# EAGLE design 2-6-2012-b (EAGLE 5.11)
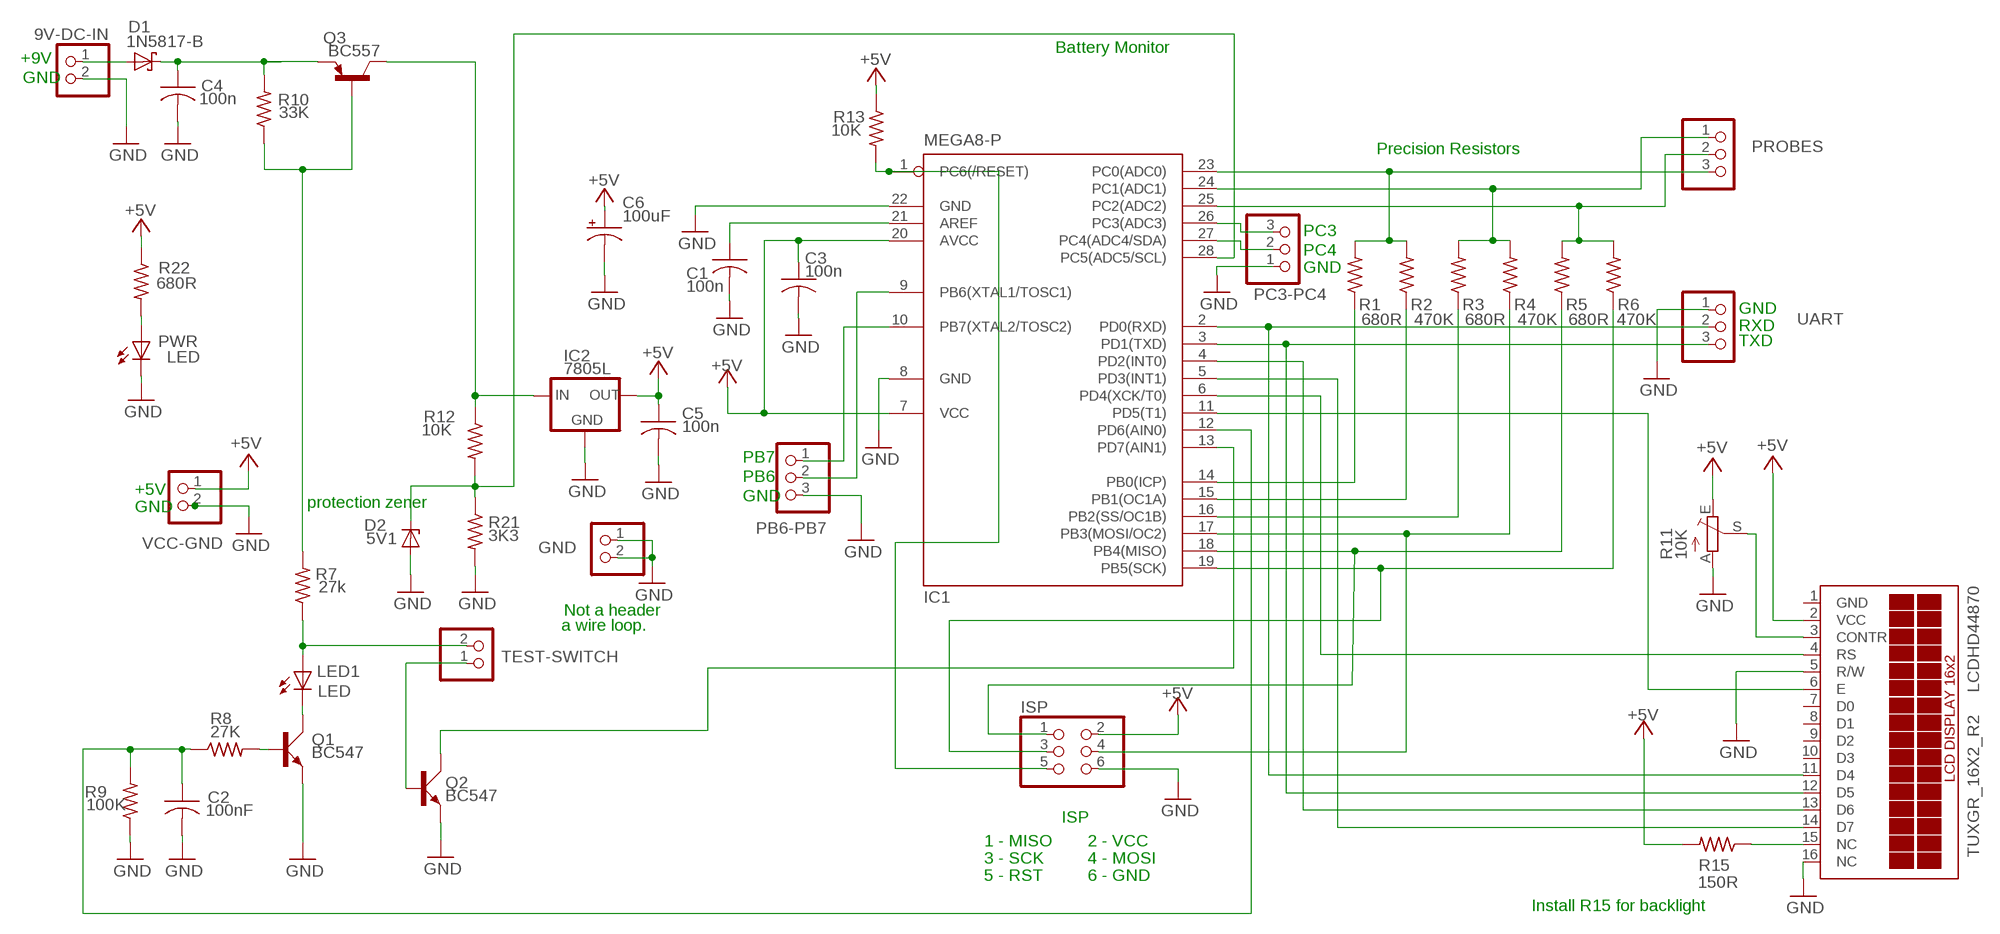
[diagram p0: schematic, sheet 1]

## Parts
9V-DC-IN  PINHD-1X2  [1X02]
C1  100n  C-US025-030X050  [C025-030X050]
C2  100nF  C-US025-030X050  [C025-030X050]
C3  100n  C-US025-030X050  [C025-030X050]
C4  100n  C-US025-030X050  [C025-030X050]
C5  100n  C-US025-030X050  [C025-030X050]
C6  100uF  CPOL-USE2-5  [E2-5]
D1  1N5817-B  [DO41-7.6]
D2  5V1  BZX55  [DO35Z10]
GND  PINHD-1X2  [1X02]
IC1  MEGA8-P  [DIL28-3]
IC2  7805L  78LXX  [78LXX]
ISP  PINHD-2X3  [2X03]
LCDHD44870  TUXGR_16X2_R2  [TUXGR_16X2_R2]
LED1  LED  LED3MM  [LED3MM]
PB6-PB7  PINHD-1X3  [1X03]
PC3-PC4  PINHD-1X3  [1X03]
PROBES  PINHD-1X3  [1X03]
PWR  LED  LED3MM  [LED3MM]
Q1  BC547  [SOT54A]
Q2  BC547  [SOT54A]
Q3  BC557  [TO92]
R1  680R  R-US_0204/7  [0204/7]
R2  470K  R-US_0204/7  [0204/7]
R3  680R  R-US_0204/7  [0204/7]
R4  470K  R-US_0204/7  [0204/7]
R5  680R  R-US_0204/7  [0204/7]
R6  470K  R-US_0204/7  [0204/7]
R7  27k  R-US_0204/7  [0204/7]
R8  27K  R-US_0204/7  [0204/7]
R9  100K  R-US_0204/7  [0204/7]
R10  33K  R-US_0204/7  [0204/7]
R11  10K  TRIM_EU-CA9V  [CA9V]
R12  10K  R-US_0204/7  [0204/7]
R13  10K  R-US_0204/7  [0204/7]
R15  150R  R-US_0204/7  [0204/7]
R21  3K3  R-US_0204/7  [0204/7]
R22  680R  R-US_0204/7  [0204/7]
TEST-SWITCH  PINHD-1X2  [1X02]
UART  PINHD-1X3  [1X03]
VCC-GND  PINHD-1X2  [1X02]

## Nets
+5V: C3.1 C5.1 C6.+ IC1.7(VCC) IC1.20(AVCC) IC2.OUT ISP.2 LCDHD44870.2(VCC) R11.E R13.1 R15.2 R22.1 VCC-GND.1
BAT-MON: D2.C IC1.28(PC5(ADC5/SCL)) R12.2 R21.1
GND: 9V-DC-IN.2 C1.2 C2.2 C3.2 C4.2 C5.2 C6.- D2.A GND.1 GND.2 IC1.8(GND) IC1.22(GND) IC2.GND ISP.6 LCDHD44870.5(R/W) LCDHD44870.16(NC) PB6-PB7.3 PC3-PC4.1 PWR.K(C) Q1.E Q2.E R9.1 R11.A R21.2 UART.1 VCC-GND.2
MISO: IC1.18(PB4(MISO)) ISP.1 R5.1
MOSI: IC1.17(PB3(MOSI/OC2)) ISP.4 R4.1
N$1: IC2.IN Q3.3(C) R12.1
N$2: 9V-DC-IN.1 D1.A
N$3: IC1.23(PC0(ADC0)) PROBES.3 R1.2 R2.2
N$4: IC1.13(PD7(AIN1)) Q2.C
N$5: IC1.25(PC2(ADC2)) PROBES.2 R5.2 R6.2
N$6: IC1.14(PB0(ICP)) R1.1
N$7: IC1.15(PB1(OC1A)) R2.1
N$8: IC1.16(PB2(SS/OC1B)) R3.1
N$9: PWR.A R22.2
N$12: Q3.2(B) R7.2 R10.1
N$13: IC1.6(PD4(XCK/T0)) LCDHD44870.4(RS)
N$15: IC1.24(PC1(ADC1)) PROBES.1 R3.2 R4.2
N$16: Q1.B R8.2
N$19: IC1.9(PB6(XTAL1/TOSC1)) PB6-PB7.2
N$20: LED1.A R7.1 TEST-SWITCH.2
N$21: LED1.K(C) Q1.C
N$22: Q2.B TEST-SWITCH.1
N$23: C2.1 IC1.12(PD6(AIN0)) R8.1 R9.2
N$24: IC1.11(PD5(T1)) LCDHD44870.6(E)
N$26: IC1.4(PD2(INT0)) LCDHD44870.13(D6)
N$27: IC1.5(PD3(INT1)) LCDHD44870.14(D7)
N$28: LCDHD44870.3(CONTR) R11.S
N$29: C1.1 IC1.21(AREF)
N$30: IC1.10(PB7(XTAL2/TOSC2)) PB6-PB7.1
N$31: LCDHD44870.15(NC) R15.1
N$33: C4.1 D1.C Q3.1(E) R10.2
N$34: IC1.26(PC3(ADC3)) PC3-PC4.3
N$37: IC1.27(PC4(ADC4/SDA)) PC3-PC4.2
RST: IC1.1(PC6(/RESET)) ISP.5 R13.2
RXD: IC1.2(PD0(RXD)) LCDHD44870.11(D4) UART.2
SCK: IC1.19(PB5(SCK)) ISP.3 R6.1
TXD: IC1.3(PD1(TXD)) LCDHD44870.12(D5) UART.3
Unconnected: LCDHD44870.7(D0) LCDHD44870.8(D1) LCDHD44870.9(D2) LCDHD44870.10(D3)

## Notes on the sheet
- Battery Monitor
- +9V
- GND
- Precision Resistors
- PC3
- PC4
- GND
- GND
- RXD
- TXD
- PB7
- PB6
- +5V
- GND
- GND | protection zener
- Not a header
- a wire loop.
- ISP
- 1 - MISO | 2 - VCC
- 3 - SCK | 4 - MOSI
- 5 - RST | 6 - GND
- Install R15 for backlight

## Power pins joined to a net without a drawn wire
GND: LCDHD44870.1(GND)

## Library data of the parts
9V-DC-IN GND TEST-SWITCH VCC-GND = pinhead:PINHD-1X2: PIN HEADER
C1-C5 = rcl:C-US: CAPACITOR, American symbol
C6 = rcl:CPOL-US: POLARIZED CAPACITOR, American symbol
D1 = diode:1N581*: 1.0A SCHOTTKY BARRIER RECTIFIER Source: http://www.diodes.com/datasheets/ds23001.pdf
D2 = diode:BZX55: Z DIODE
IC1 = atmel:MEGA8-P: MICROCONTROLLER 8 Kbytes FLASH, 1 kbytes SRAM, 512 bytes EEPROM, USART, 4-channel 10 bit ADC, 2-channel 8 bit ADC Pin compatible with Atmega48, ATMega88, ATMega168 Source: avr.lbr; OC_FARNELL: unknown; OC_NEWARK: unknown
IC2 = v-reg:78LXX: VOLTAGE REGULATOR
ISP = pinhead:PINHD-2X3: PIN HEADER
LCDHD44870 = display-lcd:TUXGR_16X2_R2: Tuxgraphics LCD display 16x2 characters reflective, without background light Source: tuxgr_12x2_r2.pdf; OC_FARNELL: unknown; OC_NEWARK: unknown
LED1 PWR = led:LED: LED OSRAM: - CHIPLED LG R971, LG N971, LY N971, LG Q971, LY Q971, LO R971, LY R971 LH N974, LH R974 LS Q976, LO Q976, LY Q976 LO Q996 - Hyper CHIPLED LW Q18S LB Q993, LB Q99A, LB R99A - SideLED LS A670, LO A670, LY A670, LG A670, LP A670 LB A673, LV A673, LT A673, LW A673 LH A674 LY A675 LS A676, LA A676, LO A676, LY A676, LW A676 LS A679, LY A679, LG A679 - Hyper Micro SIDELED® LS Y876, LA Y876, LO Y876, LY Y876 LT Y87S - SmartLED LW L88C, LW L88S LB L89C, LB L89S, LG L890 LS L89K, LO L89K, LY L89K LS L896, LA L896, LO L896, LY L896 - TOPLED LS T670, LO T670, LY T670, LG T670, LP T670 LSG T670, LSP T670, LSY T670, LOP T670, LYG T670 LG T671, LOG T671, LSG T671 LB T673, LV T673, LT T673, LW T673 LH T674 LS T676, LA T676, LO T676, LY T676, LB T676, LH T676, LSB T676, LW T676 LB T67C, LV T67C, LT T67C, LS T67K, LO T67K, LY T67K, LW E67C LS E67B, LA E67B, LO E67B, LY E67B, LB E67C, LV E67C, LT E67C LW T67C LS T679, LY T679, LG T679 LS T770, LO T770, LY T770, LG T770, LP T770 LB T773, LV T773, LT T773, LW T773 LH T774 LS E675, LA E675, LY E675, LS T675 LS T776, LA T776, LO T776, LY T776, LB T776 LHGB T686 LT T68C, LB T68C - Hyper Mini TOPLED® LB M676 - Mini TOPLED Santana® LG M470 LS M47K, LO M47K, LY M47K Source: http://www.osram.convergy.de LUXEON: - LUMILED® LXK2-PW12-R00, LXK2-PW12-S00, LXK2-PW14-U00, LXK2-PW14-V00 LXK2-PM12-R00, LXK2-PM12-S00, LXK2-PM14-U00 LXK2-PE12-Q00, LXK2-PE12-R00, LXK2-PE12-S00, LXK2-PE14-T00, LXK2-PE14-U00 LXK2-PB12-K00, LXK2-PB12-L00, LXK2-PB12-M00, LXK2-PB14-N00, LXK2-PB14-P00, LXK2-PB14-Q00 LXK2-PR12-L00, LXK2-PR12-M00, LXK2-PR14-Q00, LXK2-PR14-R00 LXK2-PD12-Q00, LXK2-PD12-R00, LXK2-PD12-S00 LXK2-PH12-R00, LXK2-PH12-S00 LXK2-PL12-P00, LXK2-PL12-Q00, LXK2-PL12-R00 Source: www.luxeon.com KINGBRIGHT: KA-3528ASYC Source: www.kingbright.com
PB6-PB7 PC3-PC4 PROBES UART = pinhead:PINHD-1X3: PIN HEADER
Q1 Q2 = transistor-small-signal:BC547: NPN TRANSISTOR
Q3 = transistor-pnp:BC557: PNP Transistor
R1-R10 R12 R13 R15 R21 R22 = rcl:R-US_: RESISTOR, American symbol
R11 = pot:TRIM_EU-: POTENTIOMETER

## Board
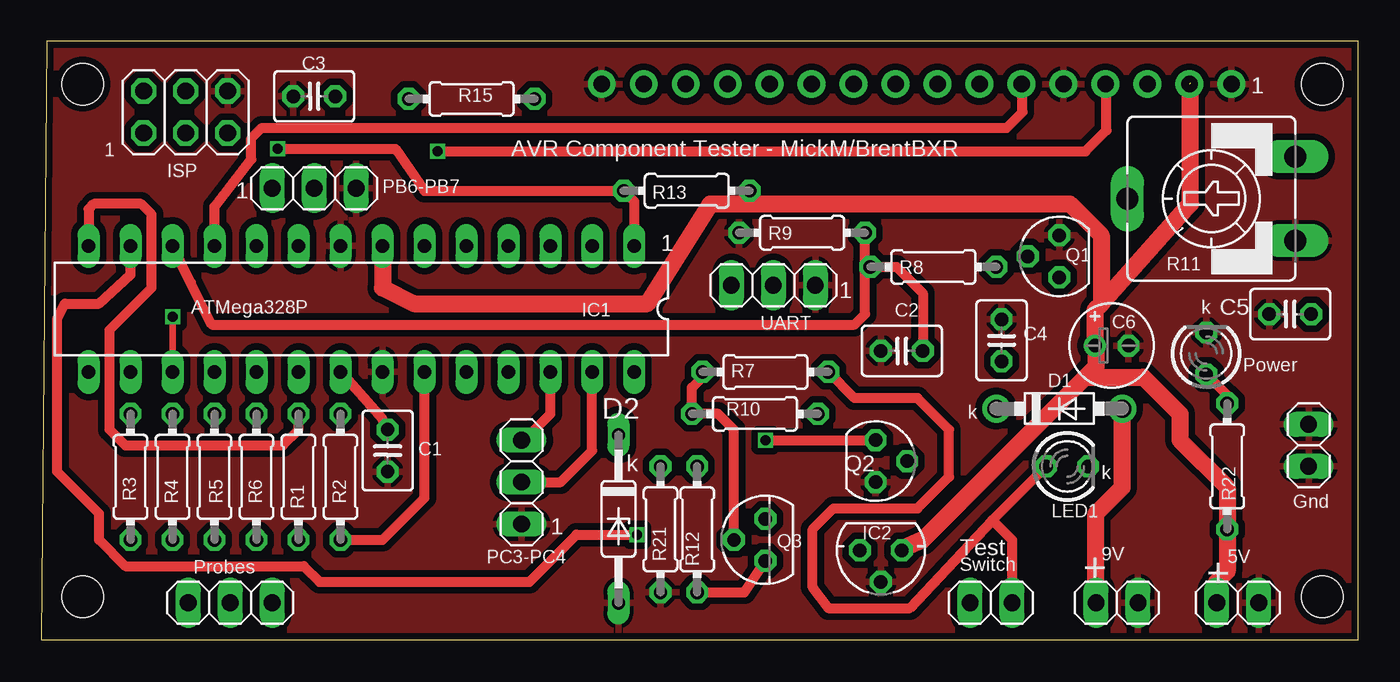
[diagram p1: board, top side]
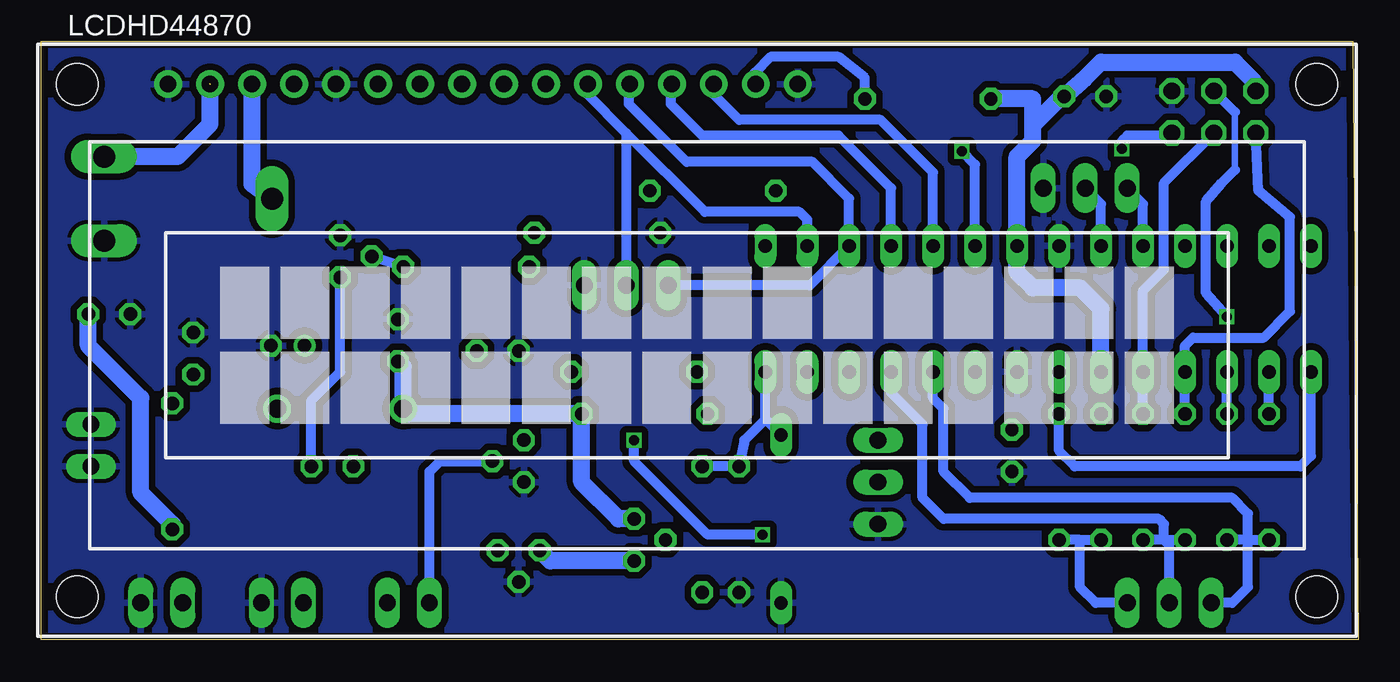
[diagram p2: board, bottom side, seen from below]

Size 79.68 x 36.18 mm. Coordinates in mm from the lower left corner, seen from the top.
Outline: 0,0 79.68,0 79.68,36.18 0.32,36.18 0,0
Copper layers (1*16): Top 0.035mm / dielectric 1.5mm / Bottom 0.035mm
Design rules "Fusion_eagle_rule_v1.1": minimum track width 6mil, minimum drill 12mil, track to track 10mil, track to pad 10mil, pad to pad 10mil, via to via 10mil, smd to smd 0mil, copper to edge 10mil, drill to drill 10mil, minimum pad ring 10mil, minimum via ring 6mil, stop-mask expansion 2mil, vias tented up to drill 100mil, thermal gap 10mil

### Footprints (pad centres in the part's own frame; a part is rotated, then mirrored left to right if it is on the bottom)
1X02 = drill 1.016 long: 1 -1.27,0; 2 1.27,0
C025-030X050 = drill 0.813 octagon: 1 -1.27,0; 2 1.27,0
E2-5 = drill 0.813 pad 1.27 round: + -1.016,0 | drill 0.813 pad 1.27 octagon: - 1.016,0
DO41-7.6 = drill 1.1 pad 1.7 round: A 3.81,0; C -3.81,0
DO35Z10 = drill 0.813 long: A 5.08,0; C -5.08,0
DIL28-3 = drill 0.813 long: 1 -16.51,-3.81; 2 -13.97,-3.81; 3 -11.43,-3.81; 4 -8.89,-3.81; 5 -6.35,-3.81; 6 -3.81,-3.81; 7 -1.27,-3.81; 8 1.27,-3.81; 9 3.81,-3.81; 10 6.35,-3.81; 11 8.89,-3.81; 12 11.43,-3.81; 13 13.97,-3.81; 14 16.51,-3.81; 15 16.51,3.81; 16 13.97,3.81; 17 11.43,3.81; 18 8.89,3.81; 19 6.35,3.81; 20 3.81,3.81; 21 1.27,3.81; 22 -1.27,3.81; 23 -3.81,3.81; 24 -6.35,3.81; 25 -8.89,3.81; 26 -11.43,3.81; 27 -13.97,3.81; 28 -16.51,3.81
78LXX = drill 0.813 octagon: GND 0,1.905; IN 1.27,0; OUT -1.27,0
2X03 = drill 1.016 octagon: 1 -2.54,-1.27; 2 -2.54,1.27; 3 0,-1.27; 4 0,1.27; 5 2.54,-1.27; 6 2.54,1.27
TUXGR_16X2_R2 = drill 1 pad 1.676 round: 1 -32,15.5; 2 -29.46,15.5; 3 -26.92,15.5; 4 -24.38,15.5; 5 -21.84,15.5; 6 -19.3,15.5; 7 -16.76,15.5; 8 -14.22,15.5; 9 -11.68,15.5; 10 -9.14,15.5; 11 -6.6,15.5; 12 -4.06,15.5; 13 -1.52,15.5; 14 1.02,15.5; 15 3.56,15.5; 16 6.1,15.5 | hole 2.5: -37.5,-15.5; 37.5,-15.5; -37.5,15.5; 37.5,15.5
LED3MM = drill 0.813 octagon: A -1.27,0; K 1.27,0
1X03 = drill 1.016 long: 1 -2.54,0; 2 0,0; 3 2.54,0
SOT54A = drill 0.813 octagon: B 0,1.905; C -1.27,0; E 1.27,0
TO92 = drill 0.813 octagon: 1 1.27,0; 2 0,1.905; 3 -1.27,0
0204/7 = drill 0.813 octagon: 1 -3.81,0; 2 3.81,0
CA9V = drill 1.321 long: A -2.54,-5.08; E 2.54,-5.08; S 0,5.08

### Placement (x,y rotation side)
9V-DC-IN  65.09,2.22 0 top
C1  20.96,11.43 270 top
C2  52.07,17.46 180 top
C3  16.51,32.86 180 top
C4  58.1,18.1 90 top
C5  75.57,19.69 180 top
C6  64.77,17.78 0 top
D1  61.59,13.97 0 top
D2  34.92,7.3 270 top
GND  76.68,11.75 90 top
IC1  19.37,20 180 top
IC2  50.8,5.4 180 top
ISP  8.73,31.91 0 top
LCDHD44870  40,18.1 0 bottom
LED1  62.07,10.48 0 top
PB6-PB7  16.51,27.31 0 top
PC3-PC4  29.05,9.52 90 top
PROBES  11.43,2.22 0 top
PWR  70.49,17.3 90 top
Q1  61.59,23.18 90 top
Q2  50.48,10.8 270 top
Q3  43.81,6.03 90 top
R1  740k  [0204/7]  15.56,9.84 270 top
R2  680R  [0204/7]  18.1,9.84 270 top
R3  740k  [0204/7]  5.4,9.84 270 top
R4  680R  [0204/7]  7.94,9.84 270 top
R5  740K  [0204/7]  10.48,9.84 270 top
R6  680R  [0204/7]  13.02,9.84 270 top
R7  43.81,16.19 180 top
R8  53.97,22.54 0 top
R9  46.04,24.61 0 top
R10  43.18,13.65 0 top
R11  70.8,26.67 90 top
R12  39.69,6.67 90 top
R13  39.05,27.15 180 top
R15  26.04,32.7 180 top
R21  37.47,6.67 270 top
R22  71.75,10.48 90 top
TEST-SWITCH  57.47,2.22 0 top
UART  44.29,21.43 180 top
VCC-GND  72.39,2.22 0 top

### Tracks (layer width: path | path; a pad name or v marks a point on that pad's centre or on a via)
+5V  (1 unrouted)
  Top 0.406: 43.02,26.35 42.86,26.51 | C6.+ 63.82,17.72
  Top 0.61: 42.86,26.51 R13.1
  Top 1.016: IC1.7 20.64,21.27 22.54,20.32 36.67,20.32 40.48,26.35 43.02,26.35 62.23,26.35 64.13,24.45 64.13,20.32 | IC2.OUT 51.91,5.4 53.34,6.03 63.18,15.88 | VCC-GND.1 71.12,3.49 71.75,4.13 R22.1 71.75,9.21 68.9,12.06 68.9,13.65 66.67,15.88 63.18,15.88 | 64.13,20.32 69.53,26.35 69.53,33.65 | 63.18,15.88 63.82,16.51 63.82,17.72 | C6.+ 63.75,19.94 64.13,20.32
  Bottom 0.406: C5.1
  Bottom 0.61: 17.94,32.86 C3.1
  Bottom 1.016: IC1.20 15.56,20 16.83,21.27 19.68,21.27 20.64,22.23 IC1.7 20.64,29.21 19.68,30.16 19.68,31.12 | R15.2 19.68,32.7 19.68,31.12 | ISP.2 6.35,33.81 7.46,34.93 15.56,34.93 16.51,33.97 C3.1 | LCDHD44870.2 69.47,31.18 71.44,29.21 R11.E | C5.1 76.83,17.78 73.66,14.6 73.66,8.89 71.75,6.98 R22.1 | 19.68,31.12 17.94,32.86
BAT-MON
  Bottom 0.61: R12.2 R21.1 37.15,12.06 35.88,13.34 | 35.88,13.34 IC1.28 | D2.C 35.88,13.34
GND
  pour Top (isolate 0.406): 0,36.51 80.01,36.2 79.69,-0.16 -0.32,-0.16
  pour Bottom (isolate 0.406): 0.32,36.51 80.01,36.51 80.01,0 0.32,0
MISO
  Bottom 0.61: ISP.1 6.03,27.15 4.13,25.56 4.13,19.84 5.71,18.26 10,18.26 10.48,17.78 IC1.18 R5.1
MOSI  (via drill 0.6)
  Top 0.406: IC1.17 v7.94,19.53
  Bottom 0.406: 7.46,28.42 7.46,31.91 | 8.25,27.62
  Bottom 0.61: v7.94,19.53 9.21,20.96 9.21,26.51 8.25,27.62 7.46,28.42 | 7.46,31.91 ISP.4 | R4.1 IC1.17
N$1
  Top 0.61: R12.1 42.55,2.86 Q3.3
  Bottom 1.016: Q3.3 48.89,4.76 IC2.IN
N$2
  Top 1.016: 9V-DC-IN.1 63.82,7.62 65.41,9.21 D1.A
N$3
  Top 0.61: R2.2 20.64,6.03 23.18,8.57 IC1.23
  Bottom 0.61: 16.83,6.03 R1.2 | 16.83,6.03 R2.2 | PROBES.3 15.88,2.22 16.83,3.17 16.83,6.03
N$4  (via drill 0.6)
  Top 0.61: IC1.13 5.4,22.07 3.49,20.32 1.43,20.32 0.95,19.37 0.95,10.16 3.49,7.62 3.49,6.03 5.08,4.45 15.88,4.45 16.83,3.49 29.53,3.49 32.39,6.35 v36.04,6.35 | v43.81,12.06 Q2.C
  Bottom 0.61: v36.04,6.35 39.37,6.35 43.81,10.8 v43.81,12.06
N$5
  Bottom 0.406: 28.42,15.4 28.42,16.03 IC1.25
  Bottom 0.61: 11.75,6.03 R5.2 | 11.75,6.03 R6.2 | PROBES.2 11.43,5.71 11.75,6.03 | 11.75,6.03 11.75,6.98 12.07,7.3 25.08,7.3 26.35,8.57 26.35,13.02 28.26,14.92 28.26,15.24 28.42,15.4
N$6
  Top 0.61: IC1.14 2.86,26.04 3.18,26.35 6.03,26.35 6.67,25.72 6.67,21.27 4.13,18.73 4.13,14.92 4.13,12.7 5.08,11.75 14.61,11.75 15.56,12.7 R1.1
N$7
  Bottom 0.406: IC1.15 2.86,12.22
  Bottom 0.61: IC1.15 2.86,11.11 3.49,10.48 17.14,10.48 18.1,11.43 R2.1
N$8
  Bottom 0.61: R3.1 IC1.16
N$9
  Top 0.61: R22.2 71.75,14.76 PWR.A
N$12
  Top 0.406: 40,15.88 R7.2
  Top 0.61: 40,15.88 39.37,15.24 R10.1 40.96,13.65 41.91,12.7 Q3.2
N$13  (via drill 0.6)
  Top 0.406: 64.45,33.53 LCDHD44870.4
  Top 0.61: v23.97,29.53 63.18,29.53 64.45,30.8 64.45,33.53
  Bottom 0.61: IC1.6 23.18,28.73 v23.97,29.53
N$15
  Bottom 0.61: 6.67,6.03 R3.2 | 6.67,6.03 R4.2 | PROBES.1 7.62,2.22 6.67,3.17 6.67,6.03 | IC1.24 25.72,14.6 25.08,13.97 25.08,10.16 23.5,8.57 7.62,8.57 6.67,7.62 6.67,6.03
N$16
  Bottom 0.61: R8.2 Q1.B
N$19
  Bottom 0.406: IC1.9 15.56,24.61
  Bottom 0.61: 15.56,24.61 15.56,26.35 PB6-PB7.2
N$20
  Top 0.61: R7.1 49.21,14.6 53.02,14.6 54.93,12.7 54.93,9.84 53.02,7.94 47.94,7.94 46.67,6.67 46.67,3.17 47.62,1.91 52.55,1.91 57.55,7.22 | 57.55,7.22 LED1.A | TEST-SWITCH.2 58.74,6.03 57.55,7.22
N$21
  Bottom 0.61: LED1.K 63.34,14.45 61.59,16.19 Q1.C
N$22
  Bottom 0.61: Q2.B 55.56,10.8 56.2,10.16 TEST-SWITCH.1
N$23
  Top 0.406: 49.85,22.54 R8.1
  Top 0.61: IC1.12 9.05,21.59 10.32,19.05 49.21,19.05 49.85,19.69 49.85,22.54 R9.2 | C2.1 53.34,20.96 51.75,22.54 R8.1
N$24
  Top 0.406: 59.37,33.53 LCDHD44870.6
  Top 0.61: 59.37,33.53 59.37,31.91 58.42,30.96 13.34,30.96 12.7,30.32 12.7,29.05 10.48,26.19 IC1.11
N$26
  Bottom 0.61: IC1.4 28.26,27.31 31.43,30.48 39.69,30.48 41.59,32.38 41.59,33.53 LCDHD44870.13
N$27
  Bottom 0.406: 39.05,33.53 LCDHD44870.14
  Bottom 0.61: IC1.5 25.72,28.26 28.89,31.43 37.47,31.43 39.05,33.02 39.05,33.53
N$28
  Bottom 1.016: LCDHD44870.3 66.92,27.56 R11.S
N$29
  Top 0.61: IC1.21 20.64,13.34 C1.1
N$30
  Bottom 0.61: IC1.10 13.02,26.35 PB6-PB7.1
N$31
  Bottom 0.406: 36.51,34.29 36.51,33.66
  Bottom 0.61: R15.1 29.85,33.97 31.43,35.24 35.56,35.24 36.51,34.29 | 36.51,33.66 LCDHD44870.15
N$33
  Bottom 0.61: 57.47,13.65 D1.C
  Bottom 1.016: 57.47,13.65 R10.2 46.99,9.52 44.77,7.3 Q3.1 | D1.C 57.78,16.51 C4.1
N$34
  Top 0.61: PC3-PC4.3 29.21,12.06 30.8,13.65 IC1.26
N$37
  Top 0.61: PC3-PC4.2 31.43,9.52 33.34,11.43 IC1.27
RST  (via drill 0.6)
  Top 0.406: R13.2 35.08,27.15
  Top 0.61: v14.29,29.69 21.43,29.69 23.18,27.15 R13.2 35.88,26.51 IC1.1
  Bottom 0.61: v14.29,29.69 14.29,30.16 13.97,30.48 11.43,30.48 ISP.5
RXD
  Bottom 0.406: 46.67,33.53 LCDHD44870.11
  Bottom 0.61: IC1.2 33.34,25.4 33.81,25.88 39.53,25.88 44.29,30.64 | 46.67,33.53 46.67,33.02 44.29,30.64 | 44.29,30.64 UART.2
SCK
  Top 0.61: IC1.19 13.02,15.88
  Bottom 0.61: ISP.3 11.75,27.62 11.75,22.38 13.02,21.11 IC1.19 R6.1
TXD
  Bottom 0.61: LCDHD44870.12 44.13,33.53 44.13,32.38 40.64,28.89 33.02,28.89 30.8,26.67 IC1.3 33.18,21.43 UART.3

### Text on the board
tPlace: 1 | 1 | AVR Component Tester - MickM/BrentBXR | ISP | 1 | PB6-PB7 | 1 | 1 | ATMega328P | k | UART | Power | k | k | k | Gnd | 1 | PC3-PC4 | Test | 9V | 5V | Probes | Switch | + | +